# EasyEDA schematic schematic.json
TITLE: Sheet_1; REV: 1.0; Date: 2025-06-11; Sheet: 1/1; Drawn By: chessthinker600; Company: Your Company
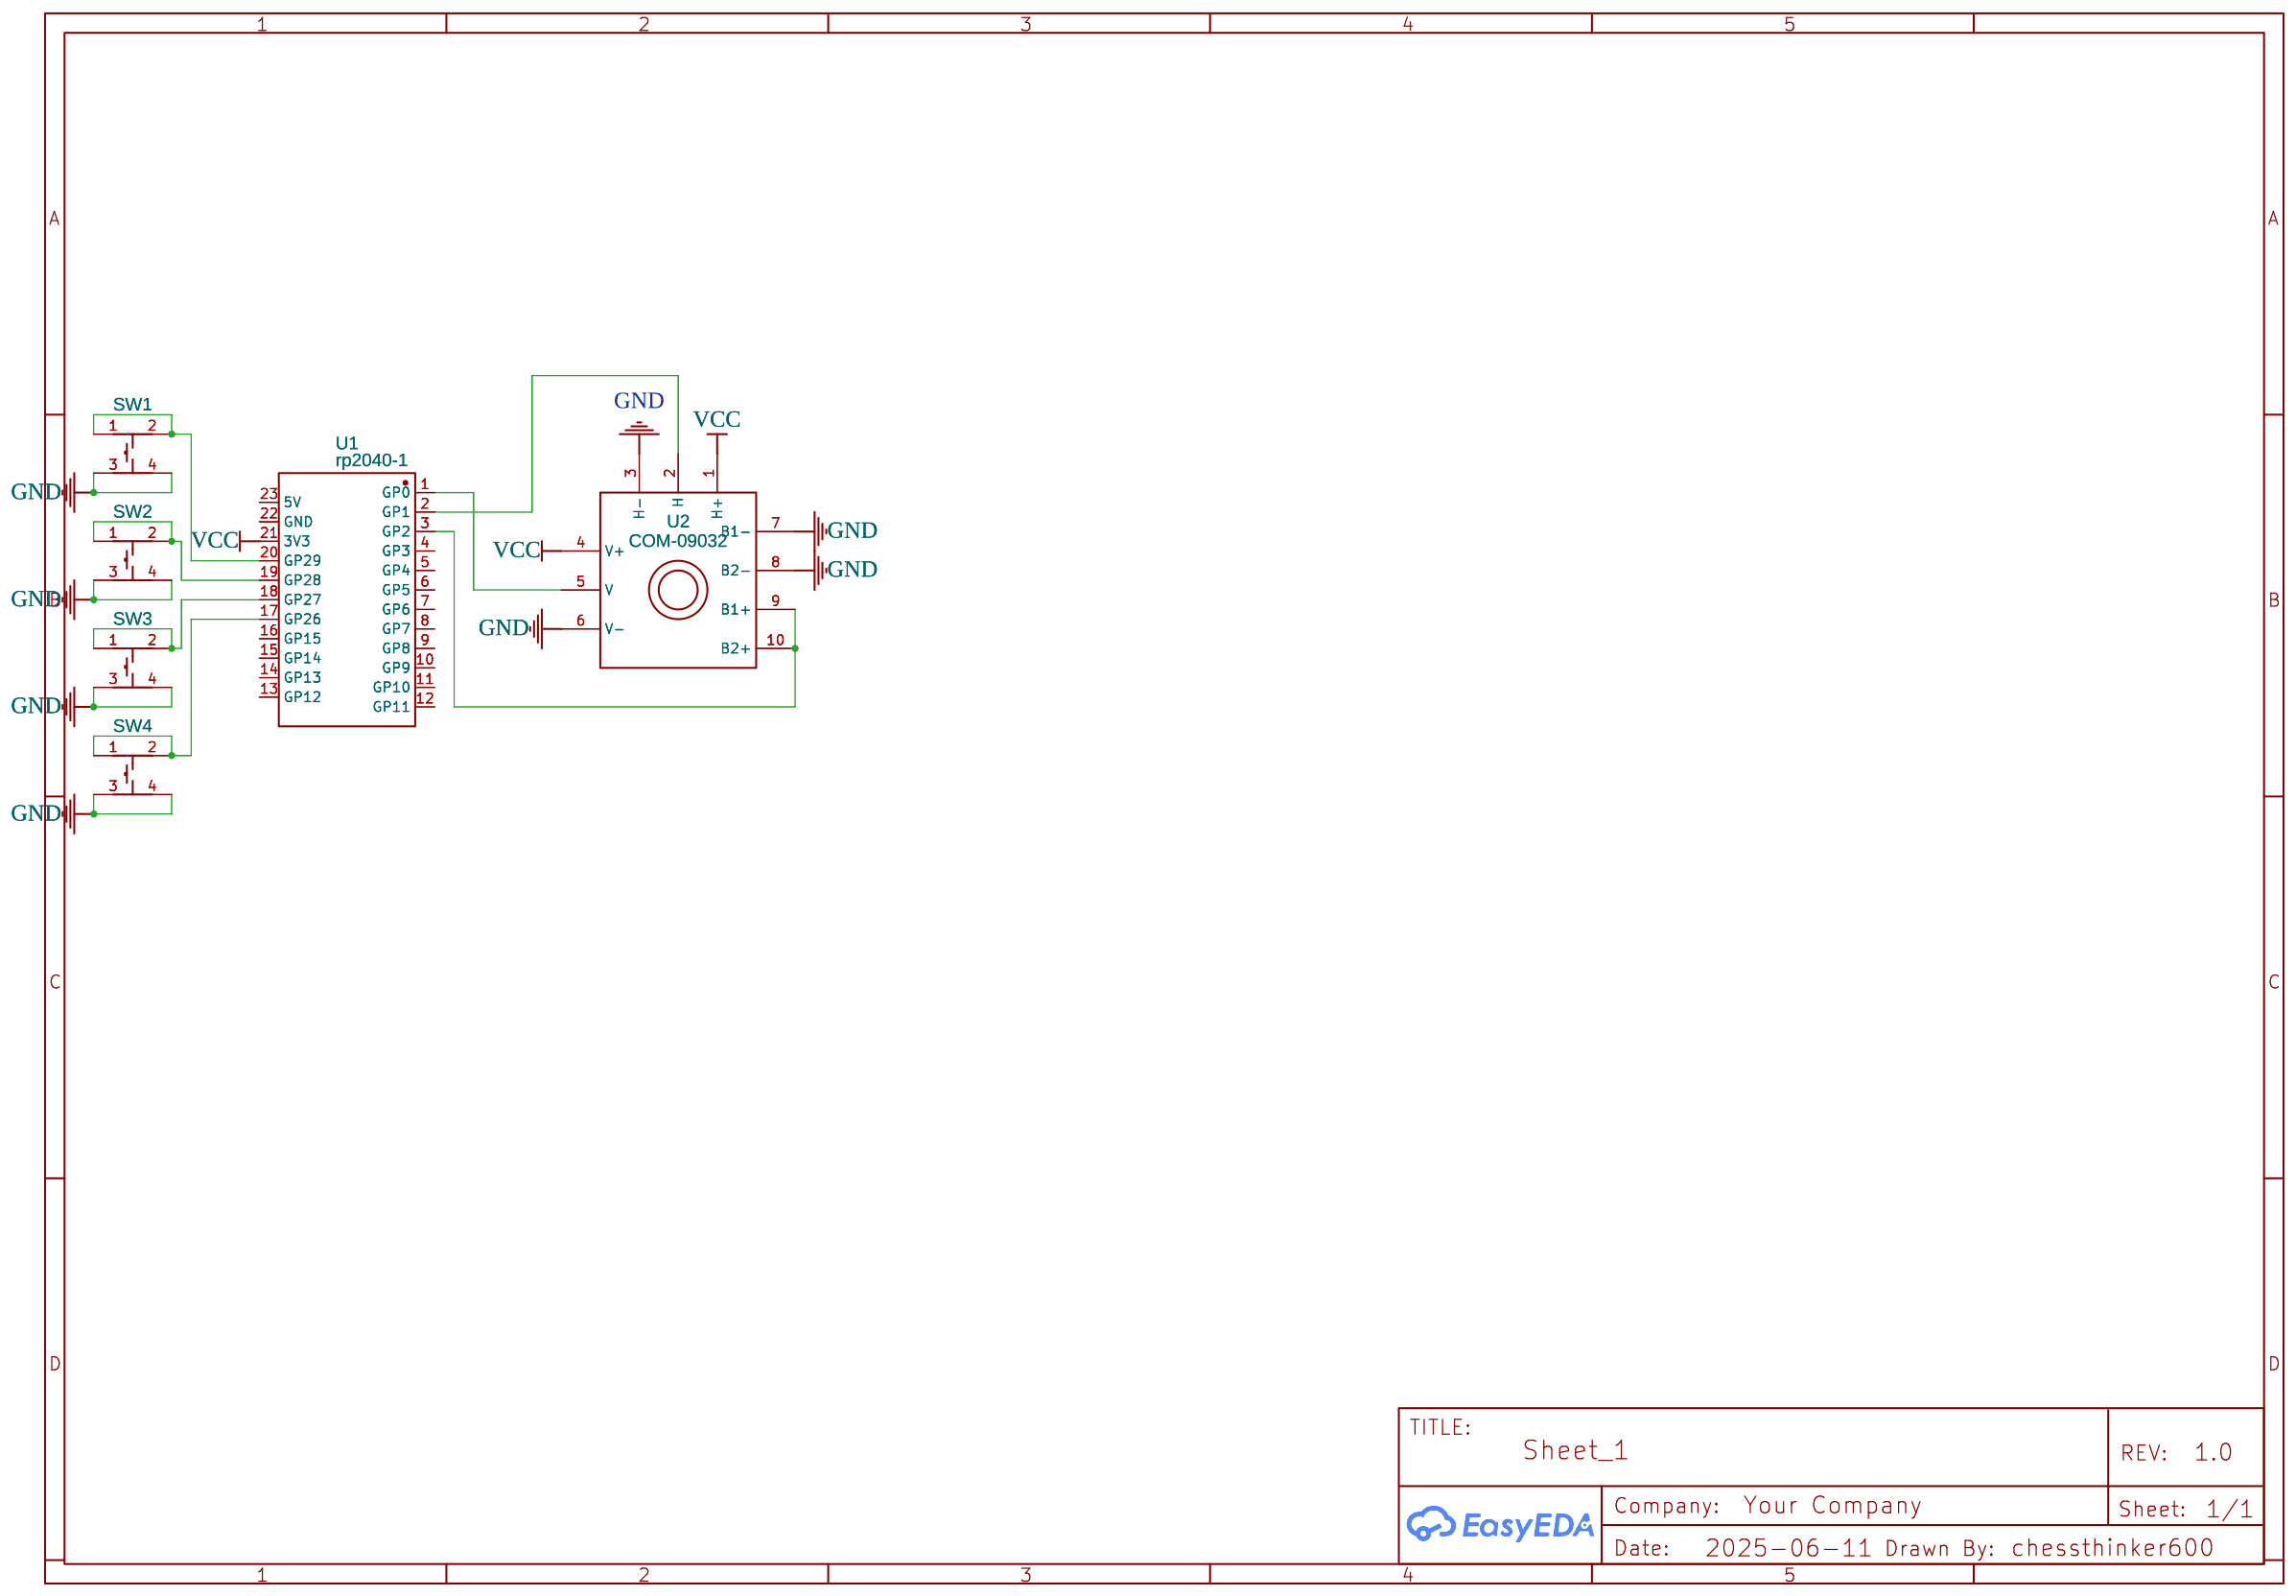
[diagram p0: schematic sheet]

## Parts
SW1  TS-1095-A10B3-D1  [SW-TH_4P-L6.0-W6.0-P4.50-LS6.5]
SW2  TS-1095-A10B3-D1  [SW-TH_4P-L6.0-W6.0-P4.50-LS6.5]
SW3  TS-1095-A10B3-D1  [SW-TH_4P-L6.0-W6.0-P4.50-LS6.5]
SW4  TS-1095-A10B3-D1  [SW-TH_4P-L6.0-W6.0-P4.50-LS6.5]
U1  rp2040-1  [NEW_FOOTPRINT]
U2  COM-09032  [COM-09032_FSADZRAD]

## Library data of the parts
SW1-SW4 = TS-1095-A10B3-D1: Contributor: LCSC; Supplier: LCSC; Supplier Part: C493052; Manufacturer: Yuandi(元迪); JLCPCB Part Class: Extended Part
U1 = RP2040-ONE COPY: Supplier: LCSC; Supplier Part: C7437605; Manufacturer: Waveshare(微雪电子); Manufacturer Part: RP2040-One; Contributor: lcsc; JLCPCB Part Class: Extended Part
U2 = COM-09032: Contributor: fsadrzad; Supplier Part: 474-COM-09032; Supplier: Sparkfun; link: https://www.sparkfun.com/tutorials/272

## Nets
GND: SW1.3 SW1.4 SW2.3 SW2.4 SW3.3 SW3.4 SW4.3 SW4.4 U2.3(H-) U2.6(V-) U2.7(B1-) U2.8(B2-)
VCC: U1.21(3V3) U2.1(H+) U2.4(V+)
Net-(SW1-1): SW1.1 SW1.2 U1.20(GP29)
Net-(SW2-1): SW2.1 SW2.2 U1.19(GP28)
Net-(SW3-1): SW3.1 SW3.2 U1.18(GP27)
Net-(SW4-1): SW4.1 SW4.2 U1.17(GP26)
Net-(U1-1): U1.1(GP0) U2.5(V)
Net-(U1-2): U1.2(GP1) U2.2(H)
Net-(U1-3): U1.3(GP2) U2.9(B1+) U2.10(B2+)

Not connected (* = marked no-connect by the designer): U1 4(GP3) 5(GP4) 6(GP5) 7(GP6) 8(GP7) 9(GP8) 10(GP9) 11(GP10) 12(GP11) 13(GP12) 14(GP13) 15(GP14) 16(GP15) 22(GND) 23(5V)
